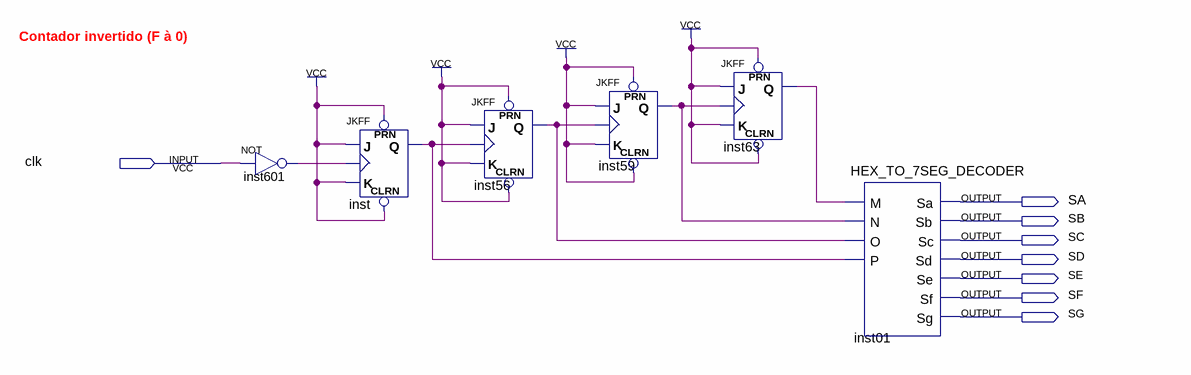
[diagram p0: schematic sheet]
// Quartus schematic Contador_v1.bdf as structural Verilog: 6 symbols, 8 pins
module Contador_v1 (
  input  clk,
  output SA,
  output SB,
  output SC,
  output SD,
  output SE,
  output SF,
  output SG
);

  wire inst56_q, inst59_q, inst63_q, inst601_out, inst_q;

  not inst601 (inst601_out, clk);
  JKFF inst (.PRN(1'b1), .CLRN(1'b1), .K(1'b1), .J(1'b1), .CLK(inst601_out), .Q(inst_q));
  JKFF inst56 (.PRN(1'b1), .CLRN(1'b1), .K(1'b1), .J(1'b1), .CLK(inst_q), .Q(inst56_q));
  JKFF inst59 (.PRN(1'b1), .CLRN(1'b1), .K(1'b1), .J(1'b1), .CLK(inst56_q), .Q(inst59_q));
  JKFF inst63 (.PRN(1'b1), .CLRN(1'b1), .K(1'b1), .J(1'b1), .CLK(inst59_q), .Q(inst63_q));
  HEX_TO_7SEG_DECODER inst01 (
    .M(inst63_q), .N(inst59_q), .O(inst56_q), .P(inst_q), .Sa(SA), .Sb(SB), .Sc(SC), .Sd(SD), .Se(SE),
    .Sf(SF), .Sg(SG));

  // Notes on the sheet:
  //   Contador invertido (F à 0)
endmodule
